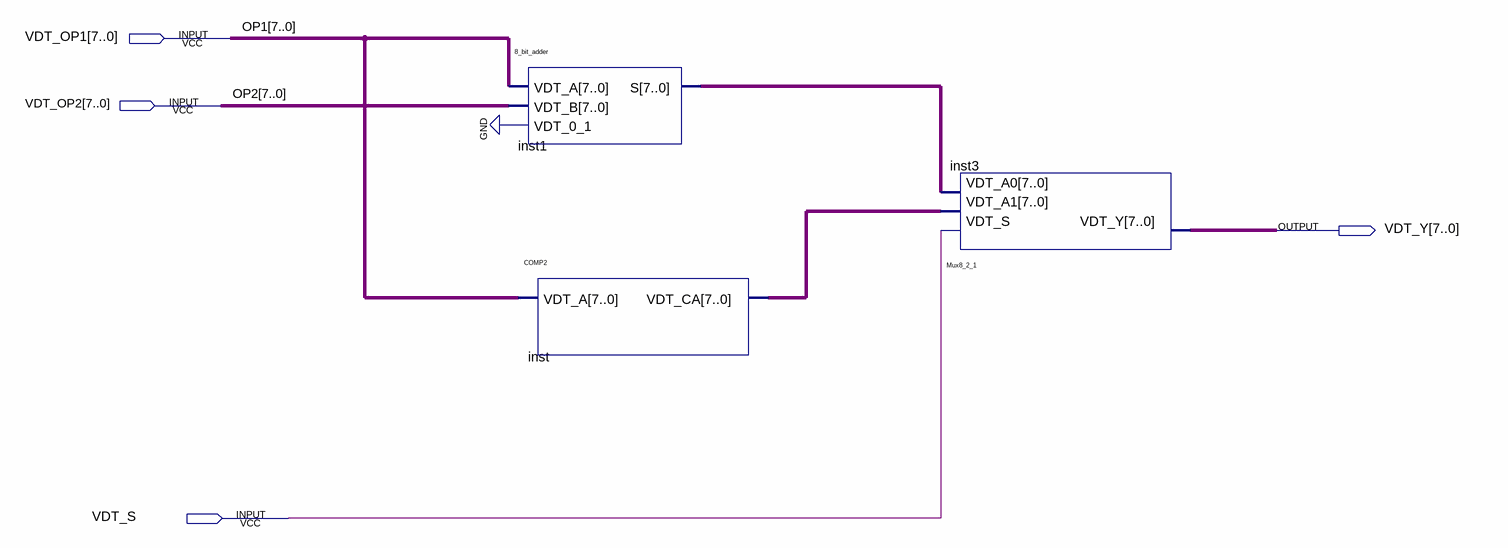
[diagram p0: schematic sheet]
// Quartus schematic assignment1.bdf as structural Verilog: 3 symbols, 4 pins
module assignment1 (
  input  [7:0] VDT_OP1,
  input  [7:0] VDT_OP2,
  input  VDT_S,
  output [7:0] VDT_Y
);

  wire [7:0] inst1_s, inst_vdt_ca;

  \8_bit_adder  inst1 (.VDT_A(VDT_OP1), .VDT_B(VDT_OP2), .VDT_0_1(1'b0), .S(inst1_s));
  COMP2 inst (.VDT_A(VDT_OP1), .VDT_CA(inst_vdt_ca));
  Mux8_2_1 inst3 (.VDT_S(VDT_S), .VDT_A1(inst_vdt_ca), .VDT_A0(inst1_s), .VDT_Y(VDT_Y));

  // Other names for the same wires on the sheet: OP1[7:0] = VDT_OP1; OP2[7:0] = VDT_OP2
endmodule
